# EAGLE schematic M8-Quad-420mA-Boost (EAGLE 9.6.2)
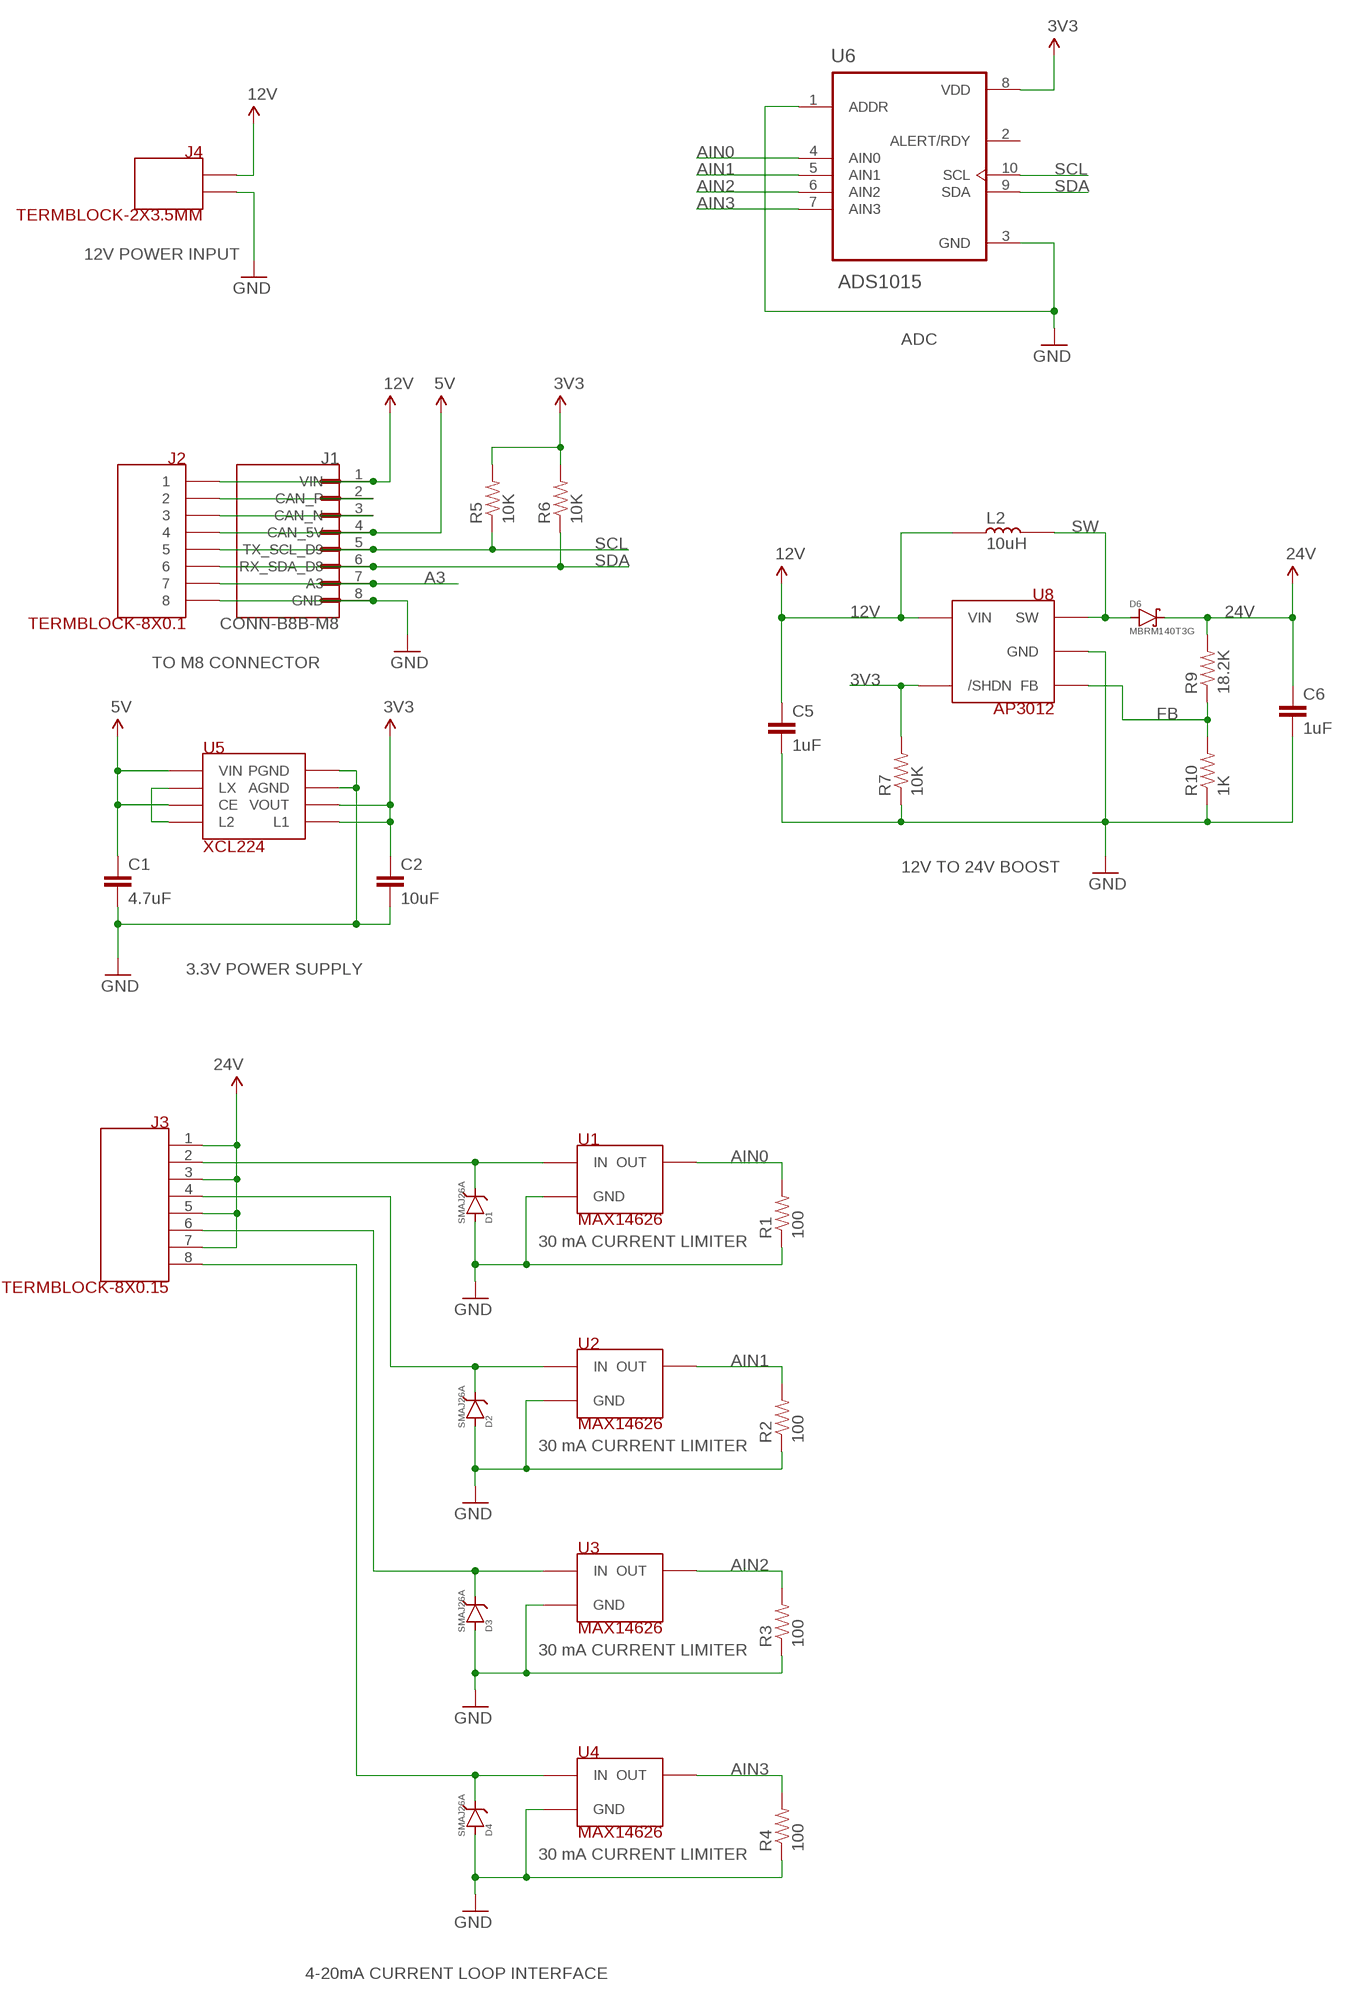
[diagram p0: schematic, sheet 1]

## Parts
C1  4.7uF  CAP-4.7UF-0603  [0603-CAP]
C2  10uF  CAP-10UF-0603  [0603-CAP]
C5  1uF  CAP-1UF-0603.DEV  [0603-CAP]
C6  1uF  CAP-1UF-0603.DEV  [0603-CAP]
D1  SMAJ26A  DIODE-TVS-SMAJ26A  [DO-214AC-LITTELFUSE]
D2  SMAJ26A  DIODE-TVS-SMAJ26A  [DO-214AC-LITTELFUSE]
D3  SMAJ26A  DIODE-TVS-SMAJ26A  [DO-214AC-LITTELFUSE]
D4  SMAJ26A  DIODE-TVS-SMAJ26A  [DO-214AC-LITTELFUSE]
D6  MBRM140T3G  [MBRM140T3G]
J1  CONN-B8B-M8  [JST_B8B-PH-SM4-TB(LF)(SN)]
J2  TERMBLOCK-8X0.1  [TERMBLOCK-8X0.1]
J3  TERMBLOCK-8X0.15  [TERMBLOCK-8X0.15]
J4  TERMBLOCK-2X3.5MM  [TERMBLOCK-2X3.5MM]
L2  10uH  INDUCTOR-10UH  [BOURNS-INDUCTOR-3X3]
R1  100  RES-100-0603.DEV  [0603-RES]
R2  100  RES-100-0603.DEV  [0603-RES]
R3  100  RES-100-0603.DEV  [0603-RES]
R4  100  RES-100-0603.DEV  [0603-RES]
R5  10K  RES-10K-06030603  [0603-RES]
R6  10K  RES-10K-06030603  [0603-RES]
R7  10K  RES-10K-06030603  [0603-RES]
R9  18.2K  RES-18.2K-06030603  [0603-RES]
R10  1K  RES-2.2K-06030603  [0603-RES]
U1  MAX14626  [6-TDFN-MAXIM]
U2  MAX14626  [6-TDFN-MAXIM]
U3  MAX14626  [6-TDFN-MAXIM]
U4  MAX14626  [6-TDFN-MAXIM]
U5  XCL224  REG-XCL223  [REG-XCL223-LESS-CREAM]
U6  ADS1015  ADS1015IDGSR  [SOP50P490X110-10N]
U8  AP3012  [SOT-23-5]

## Nets
3V3: C2.1 R5.2 R6.2 R7.2 U5.3(VOUT) U5.7(L1) U6.8(VDD) U8.4(/SHDN)
5V: C1.1 J1.4(CAN_5V) J2.P$4 U5.4(CE) U5.6(VIN)
12V: C5.1 J1.1(VIN) J2.P$1 J4.1 L2.1 U8.5(VIN)
24V: C6.1 D6.1(CATHODE) J3.1 J3.3 J3.5 J3.7 R9.2
A3: J1.7(A3) J2.P$7
AIN0: R1.2 U1.6(OUT) U6.4(AIN0)
AIN1: R2.2 U2.6(OUT) U6.5(AIN1)
AIN2: R3.2 U3.6(OUT) U6.6(AIN2)
AIN3: R4.2 U4.6(OUT) U6.7(AIN3)
CAN_N: J1.3(CAN_N) J2.P$3
CAN_P: J1.2(CAN_P) J2.P$2
FB: R9.1 R10.2 U8.3(FB)
GND: C1.2 C2.2 C5.2 C6.2 D1.A(ANODE) D2.A(ANODE) D3.A(ANODE) D4.A(ANODE) J1.8(GND) J2.P$8 J4.2 R1.1 R2.1 R3.1 R4.1 R7.1 R10.1 U1.2(GND) U1.3(GND) U1.4(GND) U1.5(GND) U1.EP(GND) U2.2(GND) U2.3(GND) U2.4(GND) U2.5(GND) U2.EP(GND) U3.2(GND) U3.3(GND) U3.4(GND) U3.5(GND) U3.EP(GND) U4.2(GND) U4.3(GND) U4.4(GND) U4.5(GND) U4.EP(GND) U5.1(PGND) U5.2(AGND) U6.1(ADDR) U6.3(GND) U8.2(GND)
LX: U5.5(LX) U5.8(L2)
SCL: J1.5(TX_SCL_D9) J2.P$5 R5.1 U6.10(SCL)
SDA: J1.6(RX_SDA_D8) J2.P$6 R6.1 U6.9(SDA)
SEN1: D1.C(CATHODE) J3.2 U1.1(IN)
SEN2: D2.C(CATHODE) J3.4 U2.1(IN)
SEN3: D3.C(CATHODE) J3.6 U3.1(IN)
SEN4: D4.C(CATHODE) J3.8 U4.1(IN)
SW: D6.2(ANODE) L2.2 U8.1(SW)
Unconnected: U6.2(ALERT/RDY)

## Notes on the sheet
- 12V POWER INPUT
- ADC
- TO M8 CONNECTOR
- 12V TO 24V BOOST
- 3.3V POWER SUPPLY
- 30 mA CURRENT LIMITER
- 30 mA CURRENT LIMITER
- 30 mA CURRENT LIMITER
- 30 mA CURRENT LIMITER
- 4-20mA CURRENT LOOP INTERFACE

## Library data of the parts
C1 = rickk2:CAP-4.7UF-0603: Murata X5R series CAP CER 4.7UF 6.3V X5R 0603 $0.12 https://www.digikey.com/product-detail/en/murata-electronics-north-america/GRM188R60J475KE19J/490-6407-1-ND/3845604
C2 = rickk2:CAP-10UF-0603: CAP CER 10UF 16V X5R 0805 $ 0.21 https://www.digikey.com/product-detail/en/murata-electronics-north-america/GRM21BR61C106KE15L/490-3886-1-ND/965928
C5 C6 = rickk2:CAP-1UF-0603.DEV: CAP CER 1UF 25V X7R 0603 $ 0.10 Samsung CL10B105KA8NNNC https://www.digikey.com/product-detail/en/samsung-electro-mechanics-america-inc/CL10B105KA8NNNC/1276-1184-1-ND/3889270 1µF ±10% 25V Ceramic Capacitor X7R 0603 (1608 Metric)
D1-D4 = rickk2:DIODE-TVS-SMAJ26A: Not ordered yet TVS diode for 24V 4-20mA circuits Littelfuse Inc. SMAJ26A $ 0.36 TVS DIODE 26V 42.1V DO214AC 42.1V Clamp 9.5A Ipp Tvs Diode Surface Mount DO-214AC (SMA) https://www.digikey.com/product-detail/en/littelfuse-inc/SMAJ26A/SMAJ26ALFCT-ND/762502 Cathode (bar/stripe side) goes to signal, anode goes to GND
D6 = rickk2:MBRM140T3G: Not ordered yet Schottky Diode for 24V boost with MIC2288 ON Semiconductor MBRM140T3G $0.36 DIODE SCHOTTKY 40V 1A POWERMITE Diode Schottky 40V 1A Surface Mount Powermite https://www.digikey.com/product-detail/en/on-semiconductor/MBRM140T3G/MBRM140T3GOSCT-ND/917997
J1 = rickk2:CONN-B8B-M8: PH Series 2 mm Pitch 12 Position SMT Single Row Top Entry Shrouded Header
J2 = rickk2:TERMBLOCK-8X0.1: Term Block 8x0.1" 20-30AWG 6A 125V Max Side Entry On Shore Technology Inc. OSTVN08A150 TERM BLK 8P SIDE ENT 2.54MM PCB 8 Position Wire to Board Terminal Block Horizontal with Board 0.100" (2.54mm) Through Hole https://www.digikey.com/product-detail/en/on-shore-technology-inc/OSTVN08A150/ED10566-ND/1588868
J3 = rickk2:TERMBLOCK-8X0.15: On Shore Technology Term Block 3.81 mm (.15”) Side with screw terminals: Plug, Female Sockets Board side: 90deg, Header, Male Pins, Shrouded (4 Side) TERM BLOCK HDR 8POS 90DEG 3.81MM $1.35 https://www.digikey.com/product-detail/en/on-shore-technology-inc/OSTOQ083251/ED2814-ND/1588131 TERM BLOCK PLUG 8POS STR 3.81MM $ 3.29 OSTTJ0831530 https://www.digikey.com/product-detail/en/on-shore-technology-inc/OSTTJ0831530/ED2881-ND/1588456
J4 = rickk2:TERMBLOCK-2X3.5MM: TERM BLK 2POS SIDE ENT 3.5MM PCB $0.67 On Shore Technology Inc. OSTTE020161M https://www.digikey.com/products/en?keywords=ED2635-ND
L2 = rickk2:INDUCTOR-10UH: Bourns Inc. SRN3015-100M $0.46 FIXED IND 10UH 1A 276 MOHM SMD 10µH Semi-Shielded Wirewound Inductor 1A 276 mOhm Max Nonstandard https://www.digikey.com/product-detail/en/bourns-inc/SRN3015-100M/SRN3015-100MCT-ND/2756149
R1-R4 = rickk2:RES-100-0603.DEV: RES SMD 100 OHM 5% 1/10W 0603 $ 0.10 ±5% 0.1W, 1/10W Chip Resistor 0603 (1608 Metric) Automotive AEC-Q200 Thick Film https://www.digikey.com/product-detail/en/panasonic-electronic-components/ERJ-3GEYJ101V/P100GCT-ND/134714
R5-R7 = rickk2:RES-10K-0603: RES SMD 10K OHM 5% 1/4W 0603 $ 0.10 https://www.digikey.com/product-detail/en/panasonic-electronic-components/ERJ-PA3J103V/P10KBZCT-ND/5036237
R9 = rickk2:RES-18.2K-0603: Panasonic Electronic Components ERJ-PB3B1822V $0.25 RES SMD 18.2K OHM 0.1% 1/5W 0603 18.2 kOhms ±0.1% 0.2W, 1/5W Chip Resistor 0603 (1608 Metric) Automotive AEC-Q200, Pulse Withstanding Thick Film https://www.digikey.com/product-detail/en/panasonic-electronic-components/ERJ-PB3B1822V/P20114CT-ND/6214369
R10 = rickk2:RES-2.2K-0603: Panasonic Electronic Components ERJ-3EKF2201V RES SMD 2.2K OHM 1% 1/10W 0603 2.2 kOhms ±1% 0.1W, 1/10W Chip Resistor 0603 (1608 Metric) Automotive AEC-Q200 Thick Film https://www.digikey.com/product-detail/en/panasonic-electronic-components/ERJ-3EKF2201V/P2.20KHCT-ND/1746742; VALUE: 2.2K
U1-U4 = rickk2:MAX14626: Not ordered yet Current limiter 30mA for 4-20mA current loop Maxim Integrated MAX14626ETT+T $1.32 IC CURR LOOP PROT 4-20MA 6TDFN https://www.digikey.com/product-detail/en/maxim-integrated/MAX14626ETT-T/MAX14626ETT-TCT-ND/4245424
U5 = rickk2:REG-XCL223: Manufacturer: Torex Semiconductor Ltd Manufacturer Part Number: XCL223A333D2-G DC DC CONVERTER 3.3V Detailed Description: Non-Isolated PoL Modul $2.63 https://www.digikey.com/product-detail/en/torex-semiconductor-ltd/XCL223A333D2-G/893-1416-1-ND/8256118 CIN=4.7uF 10V CL = 10uF 10V VIN MAX=5.5V VOUT=3.3V; VALUE: XCL223
U6 = rickk2:ADS1015IDGSR: 12-Bit ADC with Integrated MUX, PGA, Comparator, Oscillator, and Reference 10-VSSOP -40 to 125; DESCRIPTION: 12 Bit Analog to Digital Converter 2, 4 Input 1 Sigma-Delta 10-VSSOP; DIGI-KEY_PART_NUMBER: 296-41185-1-ND; MF: Texas Instruments; MP: ADS1015IDGSR; PACKAGE: MSOP-10 Texas Instruments; TEXAS_INSTRUMENTS-PURCHASE-URL: https://snapeda.com/shop?store=Texas+Instruments&id=449361
U8 = rickk2:AP3012: Diodes Incorporated AP3012KTR-G1 $0.47 IC REG BOOST ADJ 500MA SOT23-5 Boost Switching Regulator IC Positive Adjustable 1.25V 1 Output 500mA (Switch) SC-74A, SOT-753 https://www.digikey.com/product-detail/en/diodes-incorporated/AP3012KTR-G1/AP3012KTR-G1DICT-ND/4505297 Used for 12V to 24V boost for 4-20mA